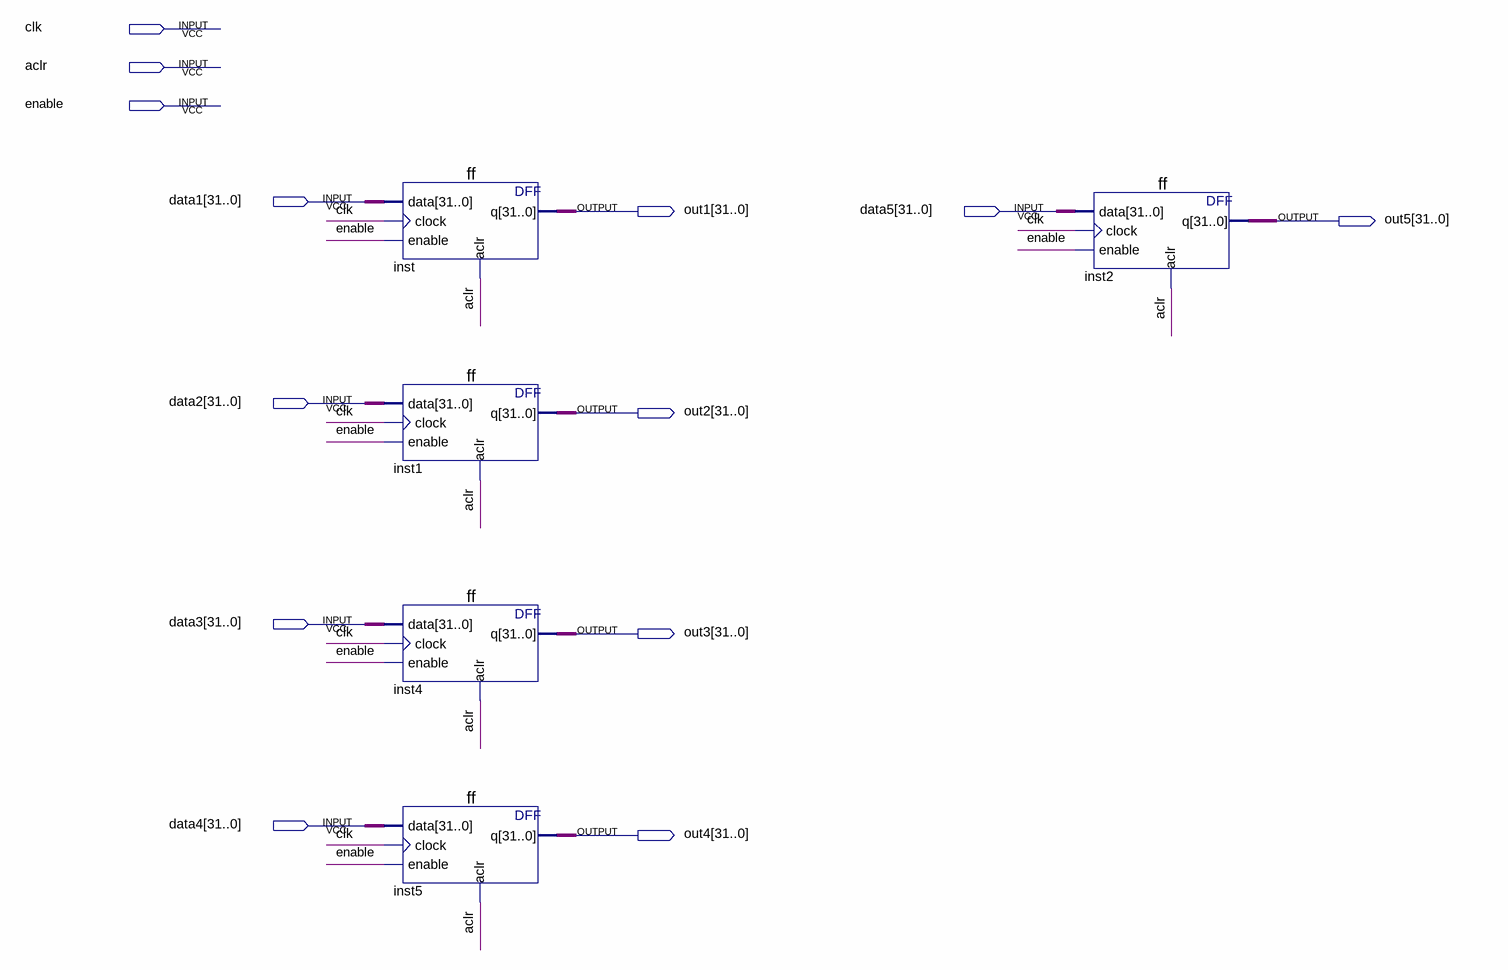
[diagram p0: schematic sheet]
// Quartus schematic buffer.bdf as structural Verilog: 5 symbols, 13 pins
module buffer (
  input  clk,
  input  aclr,
  input  enable,
  input  [31:0] data1,
  input  [31:0] data5,
  input  [31:0] data2,
  input  [31:0] data3,
  input  [31:0] data4,
  output [31:0] out1,
  output [31:0] out5,
  output [31:0] out2,
  output [31:0] out3,
  output [31:0] out4
);

  ff inst (.data(data1), .clock(clk), .enable(enable), .aclr(aclr), .q(out1));
  ff inst1 (.data(data2), .clock(clk), .enable(enable), .aclr(aclr), .q(out2));
  ff inst4 (.data(data3), .clock(clk), .enable(enable), .aclr(aclr), .q(out3));
  ff inst5 (.data(data4), .clock(clk), .enable(enable), .aclr(aclr), .q(out4));
  ff inst2 (.data(data5), .clock(clk), .enable(enable), .aclr(aclr), .q(out5));
endmodule
